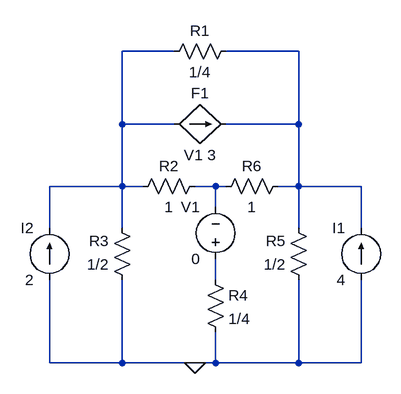
[diagram p0: schematic Draft31.asc]
Draft31.asc, the LTspice schematic file:
Version 4
SHEET 1 880 680
WIRE 192 -64 112 -64
WIRE 384 -64 272 -64
WIRE 112 48 112 -64
WIRE 192 48 112 48
WIRE 384 48 384 -64
WIRE 384 48 272 48
WIRE 112 144 112 48
WIRE 112 144 0 144
WIRE 144 144 112 144
WIRE 256 144 224 144
WIRE 272 144 256 144
WIRE 384 144 384 48
WIRE 384 144 352 144
WIRE 480 144 384 144
WIRE 256 176 256 144
WIRE 0 208 0 144
WIRE 112 208 112 144
WIRE 384 208 384 144
WIRE 480 208 480 144
WIRE 256 288 256 256
WIRE 0 416 0 288
WIRE 112 416 112 288
WIRE 112 416 0 416
WIRE 224 416 112 416
WIRE 256 416 256 368
WIRE 256 416 224 416
WIRE 384 416 384 288
WIRE 384 416 256 416
WIRE 480 416 480 288
WIRE 480 416 384 416
FLAG 224 416 0
SYMBOL res 288 -80 R90
WINDOW 0 0 56 VBottom 2
WINDOW 3 32 56 VTop 2
SYMATTR InstName R1
SYMATTR Value 1/4
SYMBOL res 240 128 R90
WINDOW 0 0 56 VBottom 2
WINDOW 3 32 56 VTop 2
SYMATTR InstName R2
SYMATTR Value 1
SYMBOL res 128 304 R180
WINDOW 0 36 76 Left 2
WINDOW 3 36 40 Left 2
SYMATTR InstName R3
SYMATTR Value 1/2
SYMBOL res 400 304 R180
WINDOW 0 36 76 Left 2
WINDOW 3 36 40 Left 2
SYMATTR InstName R5
SYMATTR Value 1/2
SYMBOL res 256 160 R270
WINDOW 0 32 56 VTop 2
WINDOW 3 0 56 VBottom 2
SYMATTR InstName R6
SYMATTR Value 1
SYMBOL f 192 48 R270
WINDOW 0 32 40 VTop 2
WINDOW 3 -32 40 VBottom 2
SYMATTR InstName F1
SYMATTR Value V1 3
SYMBOL current 480 288 R180
WINDOW 0 24 80 Left 2
WINDOW 3 24 0 Left 2
SYMATTR InstName I1
SYMATTR Value 4
SYMBOL current 0 288 R180
WINDOW 0 24 80 Left 2
WINDOW 3 24 0 Left 2
WINDOW 123 0 0 Left 0
WINDOW 39 0 0 Left 0
SYMATTR InstName I2
SYMATTR Value 2
SYMBOL voltage 256 272 R180
WINDOW 0 24 96 Left 2
WINDOW 3 24 16 Left 2
SYMATTR InstName V1
SYMATTR Value 0
SYMBOL res 240 272 R0
SYMATTR InstName R4
SYMATTR Value 1/4

The netlist it stands for:
* Draft31.asc
R1 N002 N001 1/4
R2 N003 N001 1
R3 0 N001 1/2
R5 0 N002 1/2
R6 N003 N002 1
F1 N001 N002 V1 3
I1 0 N002 4
I2 0 N001 2
V1 N004 N003 0
R4 N004 0 1/4
.backanno
.end